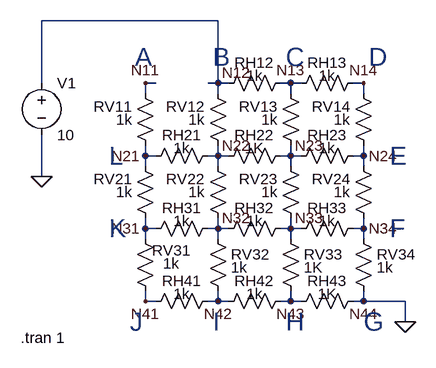
[diagram p0: schematic 4x4_grid - changed voltage-ground.asc]
4x4_grid - changed voltage-ground.asc, the LTspice schematic file:
Version 4
SHEET 1 880 680
WIRE 96 0 -176 0
WIRE -176 96 -176 0
WIRE 0 96 -16 96
WIRE 96 96 96 0
WIRE 96 96 80 96
WIRE 112 96 96 96
WIRE 208 96 192 96
WIRE 224 96 208 96
WIRE 320 96 304 96
WIRE -16 112 -16 96
WIRE 96 112 96 96
WIRE 208 112 208 96
WIRE 320 112 320 96
WIRE -16 208 -16 192
WIRE 0 208 -16 208
WIRE 96 208 96 192
WIRE 96 208 80 208
WIRE 112 208 96 208
WIRE 208 208 208 192
WIRE 208 208 192 208
WIRE 224 208 208 208
WIRE 320 208 320 192
WIRE 320 208 304 208
WIRE -16 224 -16 208
WIRE 96 224 96 208
WIRE 208 224 208 208
WIRE 320 224 320 208
WIRE -176 240 -176 176
WIRE -16 320 -16 304
WIRE 0 320 -16 320
WIRE 96 320 96 304
WIRE 96 320 80 320
WIRE 112 320 96 320
WIRE 208 320 208 304
WIRE 208 320 192 320
WIRE 224 320 208 320
WIRE 320 320 320 304
WIRE 320 320 304 320
WIRE -16 336 -16 320
WIRE 96 336 96 320
WIRE 208 336 208 320
WIRE 320 336 320 320
WIRE -16 432 -16 416
WIRE 0 432 -16 432
WIRE 96 432 96 416
WIRE 96 432 80 432
WIRE 112 432 96 432
WIRE 208 432 208 416
WIRE 208 432 192 432
WIRE 224 432 208 432
WIRE 320 432 320 416
WIRE 320 432 304 432
WIRE 384 432 320 432
WIRE 384 464 384 432
FLAG -16 96 N11
FLAG 96 96 N12
FLAG 208 96 N13
FLAG 320 96 N14
FLAG -176 240 0
FLAG 384 464 0
FLAG -16 208 N21
FLAG 96 208 N22
FLAG 208 208 N23
FLAG 320 208 N24
FLAG -16 320 N31
FLAG 96 320 N32
FLAG 208 320 N33
FLAG 320 320 N34
FLAG -16 432 N41
FLAG 96 432 N42
FLAG 208 432 N43
FLAG 320 432 N44
SYMBOL res 208 80 R90
WINDOW 0 0 56 VBottom 2
WINDOW 3 20 56 VBottom 2
SYMATTR InstName RH12
SYMATTR Value 1k
SYMBOL res 320 80 R90
WINDOW 0 0 56 VBottom 2
WINDOW 3 20 56 VBottom 2
SYMATTR InstName RH13
SYMATTR Value 1k
SYMBOL res 0 208 R180
WINDOW 0 36 76 Left 2
WINDOW 3 36 56 Left 2
SYMATTR InstName RV11
SYMATTR Value 1k
SYMBOL res 112 208 R180
WINDOW 0 36 76 Left 2
WINDOW 3 36 56 Left 2
SYMATTR InstName RV12
SYMATTR Value 1k
SYMBOL res 224 208 R180
WINDOW 0 36 76 Left 2
WINDOW 3 36 56 Left 2
SYMATTR InstName RV13
SYMATTR Value 1k
SYMBOL res 336 208 R180
WINDOW 0 36 76 Left 2
WINDOW 3 36 56 Left 2
SYMATTR InstName RV14
SYMATTR Value 1k
SYMBOL res 0 320 R180
WINDOW 0 36 76 Left 2
WINDOW 3 36 56 Left 2
SYMATTR InstName RV21
SYMATTR Value 1k
SYMBOL res -16 336 R270
WINDOW 0 32 56 VTop 2
WINDOW 3 12 56 VTop 2
SYMATTR InstName RH31
SYMATTR Value 1k
SYMBOL res 96 336 R270
WINDOW 0 32 56 VTop 2
WINDOW 3 12 56 VTop 2
SYMATTR InstName RH32
SYMATTR Value 1k
SYMBOL res 208 336 R270
WINDOW 0 32 56 VTop 2
WINDOW 3 12 56 VTop 2
SYMATTR InstName RH33
SYMATTR Value 1k
SYMBOL res 96 192 R90
WINDOW 0 0 56 VBottom 2
WINDOW 3 20 56 VBottom 2
SYMATTR InstName RH21
SYMATTR Value 1k
SYMBOL res 208 192 R90
WINDOW 0 0 56 VBottom 2
WINDOW 3 20 56 VBottom 2
SYMATTR InstName RH22
SYMATTR Value 1K
SYMBOL res 320 192 R90
WINDOW 0 0 56 VBottom 2
WINDOW 3 20 56 VBottom 2
SYMATTR InstName RH23
SYMATTR Value 1k
SYMBOL res 224 320 R180
WINDOW 0 36 76 Left 2
WINDOW 3 36 56 Left 2
SYMATTR InstName RV23
SYMATTR Value 1k
SYMBOL res 336 320 R180
WINDOW 0 36 76 Left 2
WINDOW 3 36 56 Left 2
SYMATTR InstName RV24
SYMATTR Value 1k
SYMBOL res -32 320 R0
WINDOW 0 56 49 Bottom 2
WINDOW 3 56 69 Bottom 2
SYMATTR InstName RV31
SYMATTR Value 1k
SYMBOL res 80 320 R0
WINDOW 3 36 60 Left 2
SYMATTR Value 1k
SYMATTR InstName RV32
SYMBOL res 192 320 R0
WINDOW 3 36 60 Left 2
SYMATTR Value 1K
SYMATTR InstName RV33
SYMBOL res 304 320 R0
WINDOW 3 36 60 Left 2
SYMATTR Value 1k
SYMATTR InstName RV34
SYMBOL res 96 416 R90
WINDOW 0 0 56 VBottom 2
WINDOW 3 20 56 VBottom 2
SYMATTR InstName RH41
SYMATTR Value 1k
SYMBOL res 208 416 R90
WINDOW 0 0 56 VBottom 2
WINDOW 3 20 56 VBottom 2
SYMATTR InstName RH42
SYMATTR Value 1k
SYMBOL res 320 416 R90
WINDOW 0 0 56 VBottom 2
WINDOW 3 20 56 VBottom 2
SYMATTR InstName RH43
SYMATTR Value 1K
SYMBOL voltage -176 80 R0
WINDOW 123 0 0 Left 0
WINDOW 39 0 0 Left 0
SYMATTR InstName V1
SYMATTR Value 10
SYMBOL res 112 320 R180
WINDOW 0 36 76 Left 2
WINDOW 3 36 56 Left 2
SYMATTR InstName RV22
SYMATTR Value 1k
TEXT -208 488 Left 2 !.tran 1
TEXT -32 56 Left 4 ;A
TEXT 88 56 Left 4 ;B
TEXT 200 56 Left 4 ;C
TEXT 328 56 Left 4 ;D
TEXT 360 208 Left 4 ;E
TEXT 360 320 Left 4 ;F
TEXT 320 464 Left 4 ;G
TEXT 200 464 Left 4 ;H
TEXT 88 464 Left 4 ;I
TEXT -40 464 Left 4 ;J
TEXT -72 320 Left 4 ;K
TEXT -72 208 Left 4 ;L

The netlist it stands for:
* 4x4_grid - changed voltage-ground.asc
RH12 N13 N12 1k
RH13 N14 N13 1k
RV11 N21 N11 1k
RV12 N22 N12 1k
RV13 N23 N13 1k
RV14 N24 N14 1k
RV21 N31 N21 1k
RH31 N31 N32 1k
RH32 N32 N33 1k
RH33 N33 N34 1k
RH21 N22 N21 1k
RH22 N23 N22 1K
RH23 N24 N23 1k
RV23 N33 N23 1k
RV24 N34 N24 1k
RV31 N31 N41 1k
RV32 N32 N42 1k
RV33 N33 N43 1K
RV34 N34 0 1k
RH41 N42 N41 1k
RH42 N43 N42 1k
RH43 0 N43 1K
V1 N12 0 10
RV22 N32 N22 1k
.tran 1
* A
* B
* C
* D
* E
* F
* G
* H
* I
* J
* K
* L
.backanno
.end